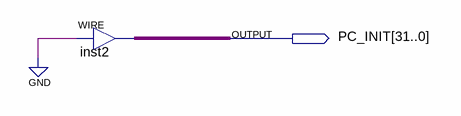
[diagram p0: schematic sheet]
// Quartus schematic pc_init.bdf as structural Verilog: 1 symbols, 1 pins
module pc_init (
  output [31:0] PC_INIT
);

  assign PC_INIT = {32{1'b0}};  // WIRE inst2
endmodule
